# Altium schematic sheet Opioid - rev.A0.SchDoc
size A4
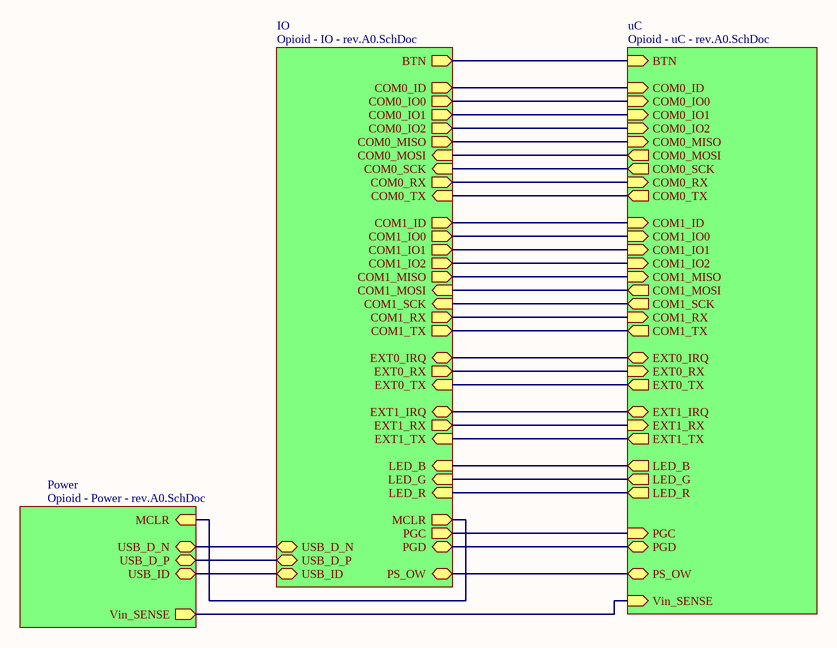
[diagram p0: Opioid - rev.A0.SchDoc]

## Sub-sheets
IO = Opioid - IO - rev.A0.SchDoc: BTN (out), COM0_ID (out), COM0_IO0 (out), COM0_IO1 (out), COM0_IO2 (out), COM0_MISO (out), COM0_MOSI (in), COM0_RX (out), COM0_TX (in), COM0_SCK (in), COM1_ID (out), COM1_IO0 (out), COM1_IO1 (out), COM1_IO2 (out), COM1_MISO (out), COM1_MOSI (in), COM1_SCK (in), COM1_RX (out), COM1_TX (out), EXT0_IRQ (bidir), EXT0_RX (out), EXT0_TX (in), EXT1_IRQ (bidir), EXT1_RX (out), EXT1_TX (in), LED_B (in), LED_G (in), LED_R (in), MCLR (out), PGC (out), PGD (bidir), PS_OW (bidir), USB_D_N (bidir), USB_D_P (bidir), USB_ID (bidir)
Power = Opioid - Power - rev.A0.SchDoc: MCLR (in), USB_D_N (bidir), USB_D_P (bidir), USB_ID (bidir), Vin_SENSE (out)
uC = Opioid - uC - rev.A0.SchDoc: BTN (in), COM0_ID (in), COM0_IO0 (in), COM0_IO1 (in), COM0_IO2 (in), COM0_MISO (in), COM0_MOSI (out), COM0_SCK (out), COM0_RX (in), COM0_TX (out), COM1_ID (in), COM1_IO0 (in), COM1_IO1 (in), COM1_IO2 (in), COM1_MISO (in), COM1_MOSI (out), COM1_SCK (out), COM1_TX (out), COM1_RX (in), EXT0_RX (in), EXT0_IRQ (bidir), EXT0_TX (out), EXT1_IRQ (bidir), EXT1_RX (in), EXT1_TX (out), LED_B (out), LED_G (out), LED_R (out), PS_OW (bidir), Vin_SENSE (in), PGC (in), PGD (bidir)

## Nets
(unnamed): sheet IO/BTN, sheet uC/BTN
(unnamed): sheet IO/COM0_ID, sheet uC/COM0_ID
(unnamed): sheet IO/COM0_IO0, sheet uC/COM0_IO0
(unnamed): sheet IO/COM0_IO1, sheet uC/COM0_IO1
(unnamed): sheet IO/COM0_IO2, sheet uC/COM0_IO2
(unnamed): sheet IO/COM0_MISO, sheet uC/COM0_MISO
(unnamed): sheet IO/COM0_MOSI, sheet uC/COM0_MOSI
(unnamed): sheet IO/COM0_RX, sheet uC/COM0_RX
(unnamed): sheet IO/COM0_TX, sheet uC/COM0_TX
(unnamed): sheet IO/COM0_SCK, sheet uC/COM0_SCK
(unnamed): sheet IO/COM1_ID, sheet uC/COM1_ID
(unnamed): sheet IO/COM1_IO0, sheet uC/COM1_IO0
(unnamed): sheet IO/COM1_IO1, sheet uC/COM1_IO1
(unnamed): sheet IO/COM1_IO2, sheet uC/COM1_IO2
(unnamed): sheet IO/COM1_MISO, sheet uC/COM1_MISO
(unnamed): sheet IO/COM1_MOSI, sheet uC/COM1_MOSI
(unnamed): sheet IO/COM1_SCK, sheet uC/COM1_SCK
(unnamed): sheet IO/COM1_RX, sheet uC/COM1_RX
(unnamed): sheet IO/COM1_TX, sheet uC/COM1_TX
(unnamed): sheet IO/EXT0_IRQ, sheet uC/EXT0_IRQ
(unnamed): sheet IO/EXT0_RX, sheet uC/EXT0_RX
(unnamed): sheet IO/EXT0_TX, sheet uC/EXT0_TX
(unnamed): sheet IO/EXT1_IRQ, sheet uC/EXT1_IRQ
(unnamed): sheet IO/EXT1_RX, sheet uC/EXT1_RX
(unnamed): sheet IO/EXT1_TX, sheet uC/EXT1_TX
(unnamed): sheet IO/LED_B, sheet uC/LED_B
(unnamed): sheet IO/LED_G, sheet uC/LED_G
(unnamed): sheet IO/LED_R, sheet uC/LED_R
(unnamed): sheet IO/MCLR, sheet Power/MCLR
(unnamed): sheet IO/PGC, sheet uC/PGC
(unnamed): sheet IO/PGD, sheet uC/PGD
(unnamed): sheet IO/PS_OW, sheet uC/PS_OW
(unnamed): sheet IO/USB_D_N, sheet Power/USB_D_N
(unnamed): sheet IO/USB_D_P, sheet Power/USB_D_P
(unnamed): sheet IO/USB_ID, sheet Power/USB_ID
(unnamed): sheet uC/Vin_SENSE, sheet Power/Vin_SENSE